# Altium schematic sheet LED_V2.0.SchDoc
size A4
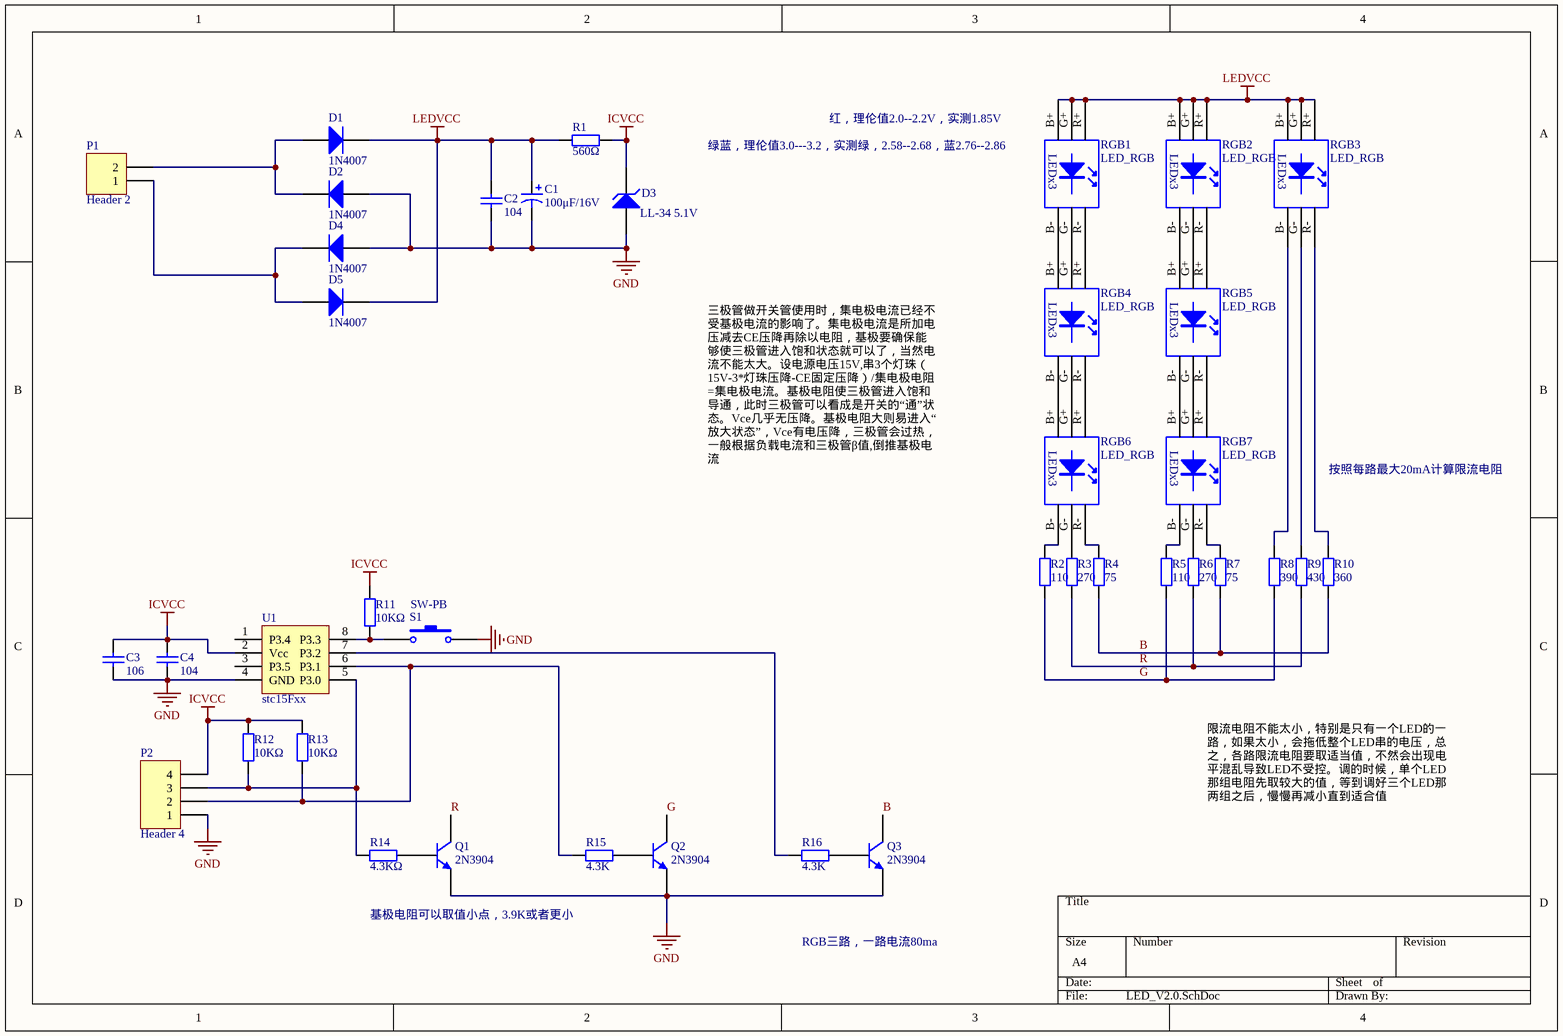
[diagram p0: LED_V2.0.SchDoc]

## Parts
C1  100μF/16V  [CAP_D5]
C2  104  [0805]
C3  106  [0805]
C4  104  [0805]
D1  1N4007  [SMB_diode]
D2  1N4007  [SMB_diode]
D3  LL-34 5.1V  [SMB_diode]
D4  1N4007  [SMB_diode]
D5  1N4007  [SMB_diode]
P1  Header 2  [CON_2PIN]
P2  Header 4  [TESTPonit_4P]
Q1  2N3904  [SOT_23]
Q2  2N3904  [SOT_23]
Q3  2N3904  [SOT_23]
R1  560Ω  [0805]
R2  110  [0805]
R3  270  [0805]
R4  75  [0805]
R5  110  [0805]
R6  270  [0805]
R7  75  [0805]
R8  390  [0805]
R9  430  [0805]
R10  360  [0805]
R11  10KΩ  [0805]
R12  10KΩ  [0805]
R13  10KΩ  [0805]
R14  4.3KΩ  [0805]
R15  4.3K  [0805]
R16  4.3K  [0805]
RGB1  LED_RGB  [RGB_5050]
RGB2  LED_RGB  [RGB_5050]
RGB3  LED_RGB  [RGB_5050]
RGB4  LED_RGB  [RGB_5050]
RGB5  LED_RGB  [RGB_5050]
RGB6  LED_RGB  [RGB_5050]
RGB7  LED_RGB  [RGB_5050]
S1  SW-PB  [SW_2]
U1  stc15Fxx  [SOP_8]

## Nets
GND: C1.2 C2.1 C3.1 C4.1 D2.1(A) D3.1(A) D4.1(A) P2.1 Q1.1(E) Q2.1(E) Q3.1(E) S1.2 U1.4(GND)
ICVCC: C3.2 C4.2 D3.2(K) P2.4 R1.2 R11.2 R12.2 R13.2 U1.2(Vcc)
LEDVCC: C1.1 C2.2 D1.2(K) D5.2(K) R1.1 RGB1.B+ RGB1.G+ RGB1.R+ RGB2.B+ RGB2.G+ RGB2.R+ RGB3.B+ RGB3.G+ RGB3.R+
B: Q3.3(C) R4.1 R7.1 R10.1
G: Q2.3(C) R2.1 R5.1 R8.1
R: Q1.3(C) R3.1 R6.1 R9.1
NetD1_1: D1.1(A) D2.2(K) P1.2
NetD4_2: D4.2(K) D5.1(A) P1.1
NetP2_2: P2.2 R13.1 R15.1 U1.6(P3.1)
NetP2_3: P2.3 R12.1 R14.1 U1.5(P3.0)
NetQ1_2: Q1.2(B) R14.2
NetQ2_2: Q2.2(B) R15.2
NetQ3_2: Q3.2(B) R16.2
NetR2_2: R2.2 RGB6.B-
NetR3_2: R3.2 RGB6.G-
NetR4_2: R4.2 RGB6.R-
NetR5_2: R5.2 RGB7.B-
NetR6_2: R6.2 RGB7.G-
NetR7_2: R7.2 RGB7.R-
NetR8_2: R8.2 RGB3.B-
NetR9_2: R9.2 RGB3.G-
NetR10_2: R10.2 RGB3.R-
NetR11_1: R11.1 S1.1 U1.8(P3.3)
NetR16_1: R16.1 U1.7(P3.2)
NetRGB1_B-: RGB1.B- RGB4.B+
NetRGB1_G-: RGB1.G- RGB4.G+
NetRGB1_R-: RGB1.R- RGB4.R+
NetRGB2_B-: RGB2.B- RGB5.B+
NetRGB2_G-: RGB2.G- RGB5.G+
NetRGB2_R-: RGB2.R- RGB5.R+
NetRGB4_B-: RGB4.B- RGB6.B+
NetRGB4_G-: RGB4.G- RGB6.G+
NetRGB4_R-: RGB4.R- RGB6.R+
NetRGB5_B-: RGB5.B- RGB7.B+
NetRGB5_G-: RGB5.G- RGB7.G+
NetRGB5_R-: RGB5.R- RGB7.R+

Not connected (* = marked no-connect by the designer): U1 1(P3.4) 3(P3.5)

## Notes on the sheet
- 绿蓝，理伦值3.0---3.2，实测绿，2.58--2.68，蓝2.76--2.86
- 红，理伦值2.0--2.2V，实测1.85V
- 三极管做开关管使用时，集电极电流已经不受基极电流的影响了。集电极电流是所加电压减去CE压降再除以电阻，基极要确保能够使三极管进入饱和状态就可以了，当然电流不能太大。设电源电压15V,串3个灯珠（15V-3*灯珠压降-CE固定压降）/集电极电阻=集电极电流。基极电阻使三极管进入饱和导通，此时三极管可以看成是开关的“通”状态。Vce几乎无压降。基极电阻大则易进入“放大状态”，Vce有电压降，三极管会过热，一般根据负载电流和三极管β值,倒推基极电流
- 按照每路最大20mA计算限流电阻
- 限流电阻不能太小，特别是只有一个LED的一路，如果太小，会拖低整个LED串的电压，总之，各路限流电阻要取适当值，不然会出现电平混乱导致LED不受控。调的时候，单个LED那组电阻先取较大的值，等到调好三个LED那两组之后，慢慢再减小直到适合值
- 基极电阻可以取值小点，3.9K或者更小
- RGB三路，一路电流80ma
- (in symbol LED_RGB) LEDx3

## Library data of the parts
C1 = Cap Pol3: Polarized Capacitor (Surface Mount); Value: 100pF; Published: 8-Jun-2000; LatestRevisionDate: 29-May-2009; LatestRevisionNote: IPC-7351 Footprint Added.; PackageReference: C0805; Publisher: Altium Limited; PackageDescription: Chip Capacitor
C2-C4 = Cap: Capacitor; Value: 100pF; Published: 8-Jun-2000; LatestRevisionDate: 17-Jul-2002; LatestRevisionNote: Re-released for DXP Platform.; PackageReference: RAD-0.3; Publisher: Altium Limited; PackageDescription: Radial Cap, Thru-Hole; 2 Leads; 0.3 in Pin Spacing
D1 D2 D4 D5 = Diode 1N4007: 1 Amp General Purpose Rectifier; Published: 8-Jun-2000; LatestRevisionDate: 17-Jul-2002; LatestRevisionNote: Re-released for DXP Platform.; DatasheetVersion: 1998; PackageVersion: Aug-1999; PackageReference: DO-41; Publisher: Altium Limited; PackageDescription: Diode, Axial; Body 5.2 x 2.7 mm (LxDia. max), Lead Dia. 0.86 mm (max); Code_JEDEC: DO-204-AL; ComponentLink1Description: Manufacturer Link; ComponentLink1URL: http://www.fairchildsemi.com/; ComponentLink2Description: Datasheet; ComponentLink2URL: http://www.fairchildsemi.com/ds/1N%2F1N4001.pdf
D3 = D Zener: Zener Diode; Published: 8-Jun-2000; LatestRevisionDate: 17-Jul-2002; LatestRevisionNote: Re-released for DXP Platform.; PackageReference: DIODE-0.7; Publisher: Altium Limited; PackageDescription: Diode, Thru-Hole; 2 Leads; 0.7 in Pin Spacing
P1 = Header 2: Header, 2-Pin; LatestRevisionDate: 17-Jul-2002; LatestRevisionNote: Re-released for DXP Platform.; Publisher: Altium Limited
P2 = Header 4: Header, 4-Pin; LatestRevisionDate: 17-Jul-2002; LatestRevisionNote: Re-released for DXP Platform.; Publisher: Altium Limited
Q1-Q3 = 2N3904: NPN General Purpose Amplifier; pin to pad: 1>E 2>B 3>C; Published: 8-Jun-2000; LatestRevisionDate: 15-Jan-2003; LatestRevisionNote: PCB Footprint 'BCY-W3/D4.7' replaced; DatasheetVersion: 1997; PackageVersion: Sep-1998; PackageReference: TO-92A; Publisher: Altium Limited; PackageDescription: TO, Flat Index; 3 In-Line, Axial Leads; Body Dia. 4.5mm; Leads 0.51 x 0.48 mm (max); ComponentLink1Description: Manufacturer Link; ComponentLink1URL: http://www.fairchildsemi.com/; ComponentLink2Description: Datasheet; ComponentLink2URL: http://www.fairchildsemi.com/ds/2N%2F2N3904.pdf
R1-R16 = Res2: Resistor; Value: 1K; Published: 8-Jun-2000; LatestRevisionDate: 17-Jul-2002; LatestRevisionNote: Re-released for DXP Platform.; PackageReference: AXIAL-0.4; Publisher: Altium Limited; PackageDescription: Axial Device, Thru-Hole; 2 Leads; 0.4 in Pin Spacing
S1 = SW-PB: Switch; Published: 24-Mar-1999; LatestRevisionDate: 17-Jul-2002; LatestRevisionNote: Re-released for DXP Platform.; PackageReference: SPST-2; Publisher: Altium Limited